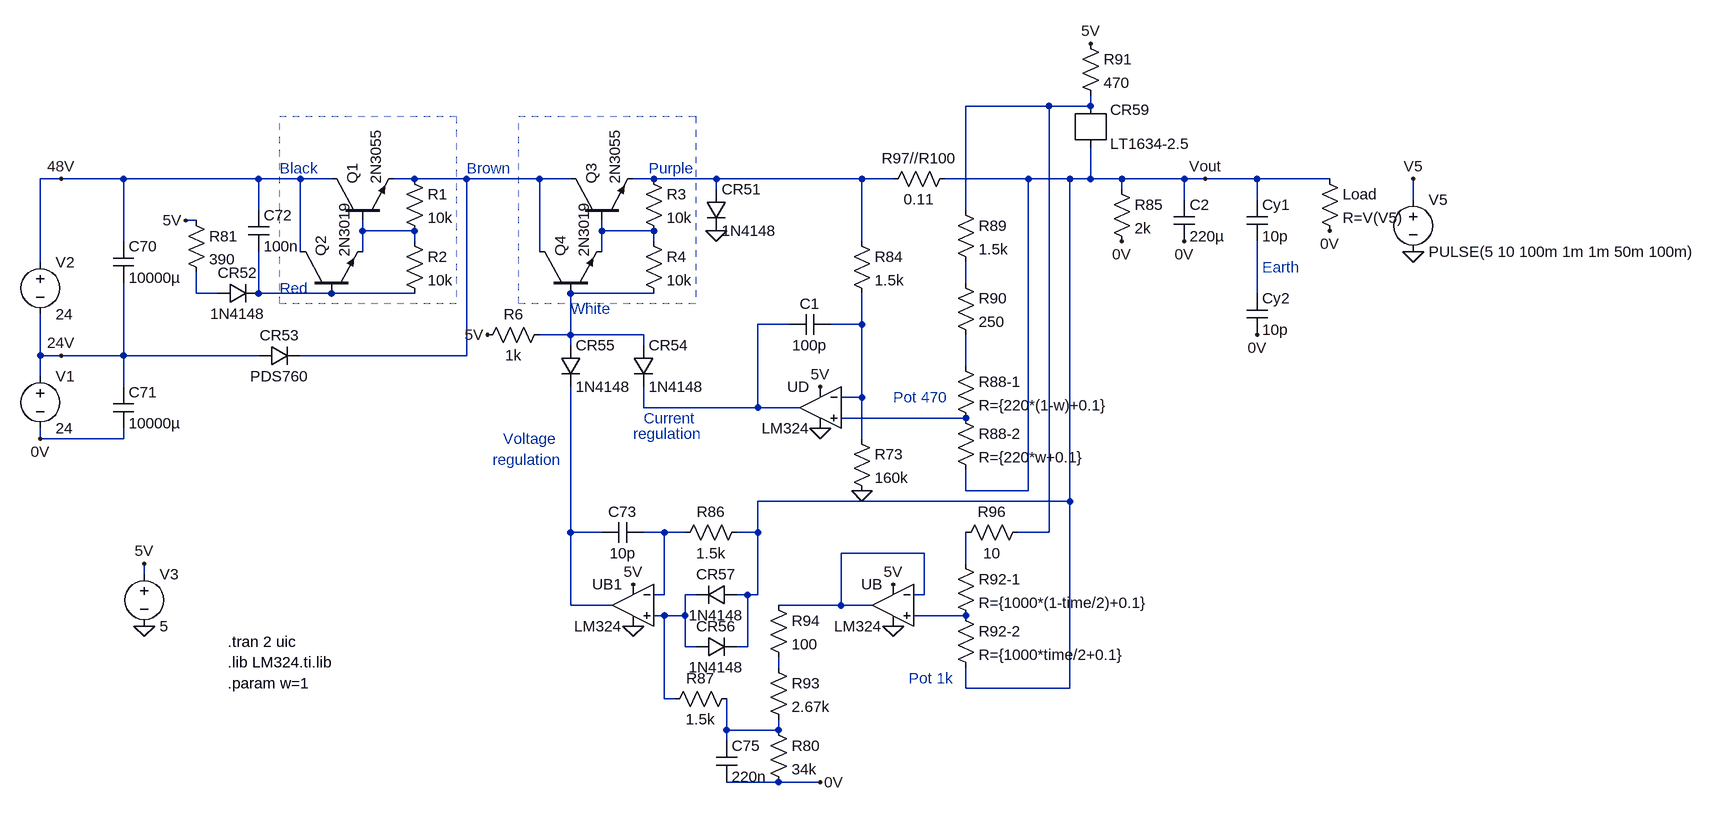
[diagram p0: schematic AX322.asc]
AX322.asc, the LTspice schematic file:
Version 4
SHEET 1 2512 796
WIRE 1488 -320 1360 -320
WIRE 1552 -320 1552 -336
WIRE 1552 -320 1488 -320
WIRE -32 -208 -64 -208
WIRE 64 -208 -32 -208
WIRE 272 -208 64 -208
WIRE 336 -208 272 -208
WIRE 384 -208 336 -208
WIRE 512 -208 480 -208
WIRE 592 -208 512 -208
WIRE 704 -208 592 -208
WIRE 752 -208 704 -208
WIRE 880 -208 848 -208
WIRE 976 -208 880 -208
WIRE 1200 -208 976 -208
WIRE 1248 -208 1200 -208
WIRE 1456 -208 1328 -208
WIRE 1520 -208 1456 -208
WIRE 1552 -208 1552 -256
WIRE 1552 -208 1520 -208
WIRE 1600 -208 1552 -208
WIRE 1696 -208 1600 -208
WIRE 1728 -208 1696 -208
WIRE 1808 -208 1728 -208
WIRE 1920 -208 1808 -208
WIRE 976 -192 976 -208
WIRE 1600 -192 1600 -208
WIRE 1696 -176 1696 -208
WIRE 1808 -176 1808 -208
WIRE 2048 -176 2048 -208
WIRE 272 -160 272 -208
WIRE 1360 -160 1360 -320
WIRE 176 -144 160 -144
WIRE 432 -128 432 -144
WIRE 512 -128 432 -128
WIRE 800 -128 800 -144
WIRE 880 -128 800 -128
WIRE 64 -112 64 -208
WIRE 512 -112 512 -128
WIRE 880 -112 880 -128
WIRE 1200 -112 1200 -208
WIRE 336 -96 336 -208
WIRE 432 -96 432 -128
WIRE 704 -96 704 -208
WIRE 800 -96 800 -128
WIRE -64 -80 -64 -208
WIRE 1360 -48 1360 -80
WIRE 176 -32 176 -64
WIRE 208 -32 176 -32
WIRE 272 -32 272 -96
WIRE 384 -32 272 -32
WIRE 512 -32 384 -32
WIRE 880 -32 752 -32
WIRE 1808 -32 1808 -112
WIRE 1088 16 1040 16
WIRE 1200 16 1200 -32
WIRE 1200 16 1152 16
WIRE 752 32 752 -32
WIRE 752 32 704 32
WIRE 864 32 752 32
WIRE 752 48 752 32
WIRE 864 48 864 32
WIRE -64 64 -64 0
WIRE -32 64 -64 64
WIRE 64 64 64 -48
WIRE 64 64 -32 64
WIRE 272 64 64 64
WIRE 592 64 592 -208
WIRE 592 64 336 64
WIRE 1360 80 1360 32
WIRE -64 96 -64 64
WIRE 64 112 64 64
WIRE 1200 128 1200 16
WIRE 1200 128 1168 128
WIRE 864 144 864 112
WIRE 1040 144 1040 16
WIRE 1040 144 864 144
WIRE 1104 144 1040 144
WIRE 1360 160 1168 160
WIRE -64 192 -64 176
WIRE 64 192 64 176
WIRE 64 192 -64 192
WIRE 1200 192 1200 128
WIRE 1360 272 1360 240
WIRE 1456 272 1456 -208
WIRE 1456 272 1360 272
WIRE 1520 288 1520 -208
WIRE 1520 288 1040 288
WIRE 752 336 752 112
WIRE 800 336 752 336
WIRE 896 336 864 336
WIRE 928 336 896 336
WIRE 1040 336 1040 288
WIRE 1040 336 1008 336
WIRE 1488 336 1488 -320
WIRE 1488 336 1440 336
WIRE 1296 368 1168 368
WIRE 1360 384 1360 336
WIRE 96 400 96 384
WIRE 896 432 896 336
WIRE 896 432 880 432
WIRE 944 432 928 432
WIRE 1024 432 1008 432
WIRE 1040 432 1040 336
WIRE 1040 432 1024 432
WIRE 1296 432 1296 368
WIRE 1296 432 1280 432
WIRE 752 448 752 336
WIRE 816 448 752 448
WIRE 1168 448 1168 368
WIRE 1168 448 1072 448
WIRE 1216 448 1168 448
WIRE 896 464 880 464
WIRE 928 464 928 432
WIRE 928 464 896 464
WIRE 1360 464 1280 464
WIRE 928 512 928 464
WIRE 944 512 928 512
WIRE 1024 512 1024 432
WIRE 1024 512 1008 512
WIRE 1072 544 1072 528
WIRE 1360 576 1360 544
WIRE 1520 576 1520 288
WIRE 1520 576 1360 576
WIRE 896 592 896 464
WIRE 912 592 896 592
WIRE 992 640 992 592
WIRE 1072 640 1072 624
WIRE 1072 640 992 640
WIRE 992 656 992 640
WIRE 1072 720 992 720
WIRE 1136 720 1072 720
FLAG 96 384 5V
FLAG 96 480 0
FLAG -32 64 24V
FLAG -32 -208 48V
FLAG -64 192 0V
FLAG 160 -144 5V
FLAG 624 32 5V
FLAG 976 -128 0
FLAG 1728 -208 Vout
FLAG 1600 -112 0V
FLAG 1552 -416 5V
FLAG 1136 112 5V
FLAG 1136 176 0
FLAG 1200 272 0
FLAG 1248 416 5V
FLAG 1248 480 0
FLAG 1136 720 0V
FLAG 848 416 5V
FLAG 848 480 0
FLAG 1920 -128 0V
FLAG 2048 -96 0
FLAG 2048 -208 V5
FLAG 1696 -112 0V
FLAG 1808 32 0V
SYMBOL voltage -64 80 R0
WINDOW 123 0 0 Left 0
WINDOW 39 0 0 Left 0
SYMATTR InstName V1
SYMATTR Value 24
SYMBOL voltage -64 -96 R0
WINDOW 123 0 0 Left 0
WINDOW 39 0 0 Left 0
SYMATTR InstName V2
SYMATTR Value 24
SYMBOL voltage 96 384 R0
WINDOW 123 0 0 Left 0
WINDOW 39 0 0 Left 0
SYMATTR InstName V3
SYMATTR Value 5
SYMBOL npn 384 -144 R270
SYMATTR InstName Q1
SYMATTR Value 2N3055
SYMBOL npn 336 -32 R270
SYMATTR InstName Q2
SYMATTR Value 2N3019
SYMBOL res 496 -224 R0
SYMATTR InstName R1
SYMATTR Value 10k
SYMBOL res 496 -128 R0
SYMATTR InstName R2
SYMATTR Value 10k
SYMBOL npn 752 -144 R270
SYMATTR InstName Q3
SYMATTR Value 2N3055
SYMBOL npn 704 -32 R270
SYMATTR InstName Q4
SYMATTR Value 2N3019
SYMBOL res 864 -224 R0
SYMATTR InstName R3
SYMATTR Value 10k
SYMBOL res 864 -128 R0
SYMATTR InstName R4
SYMATTR Value 10k
SYMBOL diode 208 -16 R270
WINDOW 0 32 32 VTop 2
WINDOW 3 0 32 VBottom 2
SYMATTR InstName CR52
SYMATTR Value 1N4148
SYMBOL res 160 -160 R0
SYMATTR InstName R81
SYMATTR Value 390
SYMBOL diode 272 80 R270
WINDOW 0 32 32 VTop 2
WINDOW 3 0 32 VBottom 2
SYMATTR InstName CR53
SYMATTR Value PDS760
SYMBOL res 720 16 R90
WINDOW 0 0 56 VBottom 2
WINDOW 3 32 56 VTop 2
SYMATTR InstName R6
SYMATTR Value 1k
SYMBOL diode 960 -192 R0
SYMATTR InstName CR51
SYMATTR Value 1N4148
SYMBOL diode 736 48 R0
SYMATTR InstName CR55
SYMATTR Value 1N4148
SYMBOL diode 848 48 R0
SYMATTR InstName CR54
SYMATTR Value 1N4148
SYMBOL res 1344 -224 R90
WINDOW 0 0 56 VBottom 2
WINDOW 3 32 56 VTop 2
SYMATTR InstName R97//R100
SYMATTR Value 0.11
SYMBOL res 1584 -208 R0
SYMATTR InstName R85
SYMATTR Value 2k
SYMBOL References\\LT1634-2.5 1552 -288 R0
SYMATTR InstName CR59
SYMBOL res 1536 -432 R0
SYMATTR InstName R91
SYMATTR Value 470
SYMBOL OpAmps\\opamp2 1136 80 M0
SYMATTR InstName UD
SYMATTR Value LM324
SYMBOL cap 1088 0 M90
WINDOW 0 0 32 VBottom 2
WINDOW 3 32 32 VTop 2
SYMATTR InstName C1
SYMATTR Value 100p
SYMBOL res 1184 176 R0
SYMATTR InstName R73
SYMATTR Value 160k
SYMBOL res 1184 -128 R0
SYMATTR InstName R84
SYMATTR Value 1.5k
SYMBOL res 1344 -176 R0
SYMATTR InstName R89
SYMATTR Value 1.5k
SYMBOL res 1344 -64 R0
SYMATTR InstName R90
SYMATTR Value 250
SYMBOL res 1344 64 R0
SYMATTR InstName R88-1
SYMATTR Value R={220*(1-w)+0.1}
SYMBOL res 1344 144 R0
SYMATTR InstName R88-2
SYMATTR Value R={220*w+0.1}
SYMBOL OpAmps\\opamp2 1248 384 M0
SYMATTR InstName UB
SYMATTR Value LM324
SYMBOL res 1344 368 R0
SYMATTR InstName R92-1
SYMATTR Value R={1000*(1-time/2)+0.1}
SYMBOL res 1344 448 R0
SYMATTR InstName R92-2
SYMATTR Value R={1000*time/2+0.1}
SYMBOL res 1456 320 R90
WINDOW 0 0 56 VBottom 2
WINDOW 3 32 56 VTop 2
SYMATTR InstName R96
SYMATTR Value 10
SYMBOL res 1056 432 R0
SYMATTR InstName R94
SYMATTR Value 100
SYMBOL res 1056 528 R0
SYMATTR InstName R93
SYMATTR Value 2.67k
SYMBOL res 1056 624 R0
SYMATTR InstName R80
SYMATTR Value 34k
SYMBOL cap 976 656 R0
SYMATTR InstName C75
SYMATTR Value 220n
SYMBOL OpAmps\\opamp2 848 384 M0
SYMATTR InstName UB1
SYMATTR Value LM324
SYMBOL cap 864 320 R90
WINDOW 0 0 32 VBottom 2
WINDOW 3 32 32 VTop 2
SYMATTR InstName C73
SYMATTR Value 10p
SYMBOL res 1024 320 R90
WINDOW 0 0 56 VBottom 2
WINDOW 3 32 56 VTop 2
SYMATTR InstName R86
SYMATTR Value 1.5k
SYMBOL res 1008 576 R90
WINDOW 0 0 56 VBottom 2
WINDOW 3 32 56 VTop 2
SYMATTR InstName R87
SYMATTR Value 1.5k
SYMBOL diode 1008 416 R90
WINDOW 0 0 32 VBottom 2
WINDOW 3 32 32 VTop 2
SYMATTR InstName CR57
SYMATTR Value 1N4148
SYMBOL diode 944 528 R270
WINDOW 0 32 32 VTop 2
WINDOW 3 0 32 VBottom 2
SYMATTR InstName CR56
SYMATTR Value 1N4148
SYMBOL res 1904 -224 R0
SYMATTR InstName Load
SYMATTR Value R=V(V5)
SYMBOL voltage 2048 -192 R0
WINDOW 123 0 0 Left 0
WINDOW 39 0 0 Left 0
SYMATTR InstName V5
SYMATTR Value PULSE(5 10 100m 1m 1m 50m 100m)
SYMBOL cap 1680 -176 R0
SYMATTR InstName C2
SYMATTR Value 220µ
SYMBOL cap 256 -160 R0
SYMATTR InstName C72
SYMATTR Value 100n
SYMBOL cap 1792 -176 R0
SYMATTR InstName Cy1
SYMATTR Value 10p
SYMBOL cap 1792 -32 R0
SYMATTR InstName Cy2
SYMATTR Value 10p
SYMBOL cap 48 -112 R0
SYMATTR InstName C70
SYMATTR Value 10000µ
SYMBOL cap 48 112 R0
SYMATTR InstName C71
SYMATTR Value 10000µ
TEXT 224 504 Left 2 !.tran 2 uic
TEXT 224 536 Left 2 !.lib LM324.ti.lib
TEXT 224 568 Left 2 !.param w=1
TEXT 1248 128 Left 2 ;Pot 470
TEXT 1272 560 Left 2 ;Pot 1k
TEXT 304 -224 Left 2 ;Black
TEXT 592 -224 Left 2 ;Brown
TEXT 872 -224 Left 2 ;Purple
TEXT 304 -40 Left 2 ;Red
TEXT 752 -8 Left 2 ;White
TEXT 1816 -72 Left 2 ;Earth
TEXT 864 160 Left 2 ;Current
TEXT 648 192 Left 2 ;Voltage
TEXT 632 224 Left 2 ;regulation
TEXT 848 184 Left 2 ;regulation
RECTANGLE Normal 944 -16 672 -304 2
RECTANGLE Normal 576 -16 304 -304 2

The netlist it stands for:
* AX322.asc
V1 24V 0V 24
V2 48V 24V 24
V3 5V 0 5
Q1 48V N004 N002 0 2N3055
Q2 48V N008 N004 0 2N3019
R1 N002 N004 10k
R2 N004 N008 10k
Q3 N002 N005 N003 0 2N3055
Q4 N002 N009 N005 0 2N3019
R3 N003 N005 10k
R4 N005 N009 10k
D§CR52 N007 N008 1N4148
R81 5V N007 390
D§CR53 24V N002 PDS760
R6 N009 5V 1k
D§CR51 N003 0 1N4148
D§CR55 N009 N015 1N4148
D§CR54 N009 N011 1N4148
R97//R100 Vout N003 0.11
R85 Vout 0V 2k
XCR59 N001 Vout LT1634-2.5
R91 5V N001 470
XUD N014 N012 5V 0 N011 LM324  ; pins In+ In- V+ V- OUT
C1 N011 N012 100p
R73 N012 0 160k
R84 N003 N012 1.5k
R89 N001 N006 1.5k
R90 N006 N013 250
R88-1 N013 N014 R={220*(1-w)+0.1}
R88-2 N014 Vout R={220*w+0.1}
XUB N020 N017 5V 0 N017 LM324  ; pins In+ In- V+ V- OUT
R92-1 N018 N020 R={1000*(1-time/2)+0.1}
R92-2 N020 Vout R={1000*time/2+0.1}
R96 N001 N018 10
R94 N017 N021 100
R93 N021 N022 2.67k
R80 N022 0V 34k
C75 N022 0V 220n
XUB1 N019 N016 5V 0 N015 LM324  ; pins In+ In- V+ V- OUT
C73 N016 N015 10p
R86 Vout N016 1.5k
R87 N022 N019 1.5k
D§CR57 Vout N019 1N4148
D§CR56 N019 Vout 1N4148
R§Load Vout 0V R=V(V5)
V5 V5 0 PULSE(5 10 100m 1m 1m 50m 100m)
C2 Vout 0V 220µ
C72 48V N008 100n
Cy1 Vout N010 10p
Cy2 N010 0V 10p
C70 48V 24V 10000µ
C71 24V 0V 10000µ
.model D D
.lib standard.dio
.model NPN NPN
.model PNP PNP
.lib standard.bjt
.tran 2 uic
.lib LM324.ti.lib
.param w=1
* Pot 470
* Pot 1k
* Black
* Brown
* Purple
* Red
* White
* Earth
* Current
* Voltage
* regulation
* regulation
.backanno
.end